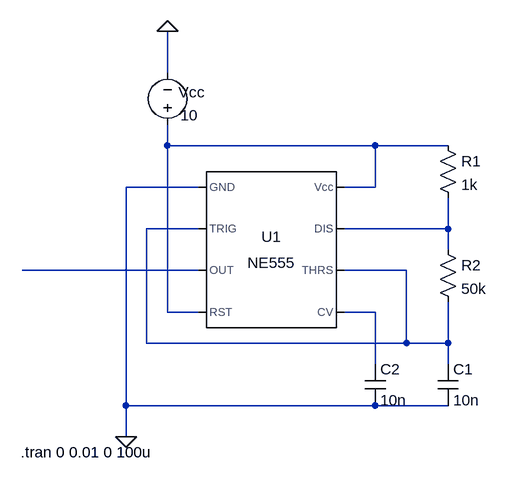
[diagram p0: schematic Draft3.asc]
Draft3.asc, the LTspice schematic file:
Version 4
SHEET 1 880 680
WIRE 48 -80 48 -144
WIRE 48 32 48 0
WIRE 368 32 48 32
WIRE 480 32 368 32
WIRE 96 96 -16 96
WIRE 368 96 368 32
WIRE 368 96 320 96
WIRE 96 160 16 160
WIRE 480 160 480 112
WIRE 480 160 320 160
WIRE 480 192 480 160
WIRE 96 224 -176 224
WIRE 416 224 320 224
WIRE 48 288 48 32
WIRE 96 288 48 288
WIRE 368 288 320 288
WIRE 16 336 16 160
WIRE 416 336 416 224
WIRE 416 336 16 336
WIRE 480 336 480 272
WIRE 480 336 416 336
WIRE 368 368 368 288
WIRE 480 368 480 336
WIRE -16 432 -16 96
WIRE 368 432 -16 432
WIRE 480 432 368 432
WIRE -16 480 -16 432
FLAG -16 480 0
FLAG 48 -144 0
SYMBOL Misc\\NE555 208 192 R0
SYMATTR InstName U1
SYMBOL res 464 16 R0
SYMATTR InstName R1
SYMATTR Value 1k
SYMBOL res 464 176 R0
SYMATTR InstName R2
SYMATTR Value 50k
SYMBOL voltage 48 16 R180
WINDOW 0 -57 66 Left 2
WINDOW 3 -47 31 Left 2
SYMATTR InstName Vcc
SYMATTR Value 10
SYMBOL cap 352 368 R0
SYMATTR InstName C2
SYMATTR Value 10n
SYMBOL cap 464 368 R0
SYMATTR InstName C1
SYMATTR Value 10n
TEXT -178 504 Left 2 !.tran 0 0.01 0 100u

The netlist it stands for:
* Draft3.asc
XU1 0 N002 N004 N001 N005 N002 N003 N001 NE555  ; pins GND TRIG OUT RST CV THRS DIS Vcc
R1 N001 N003 1k
R2 N003 N002 50k
Vcc N001 0 10
C2 N005 0 10n
C1 N002 0 10n
.tran 0 0.01 0 100u
.lib NE555.sub
.backanno
.end